# EAGLE schematic PCI da FPGA (EAGLE 6.3)
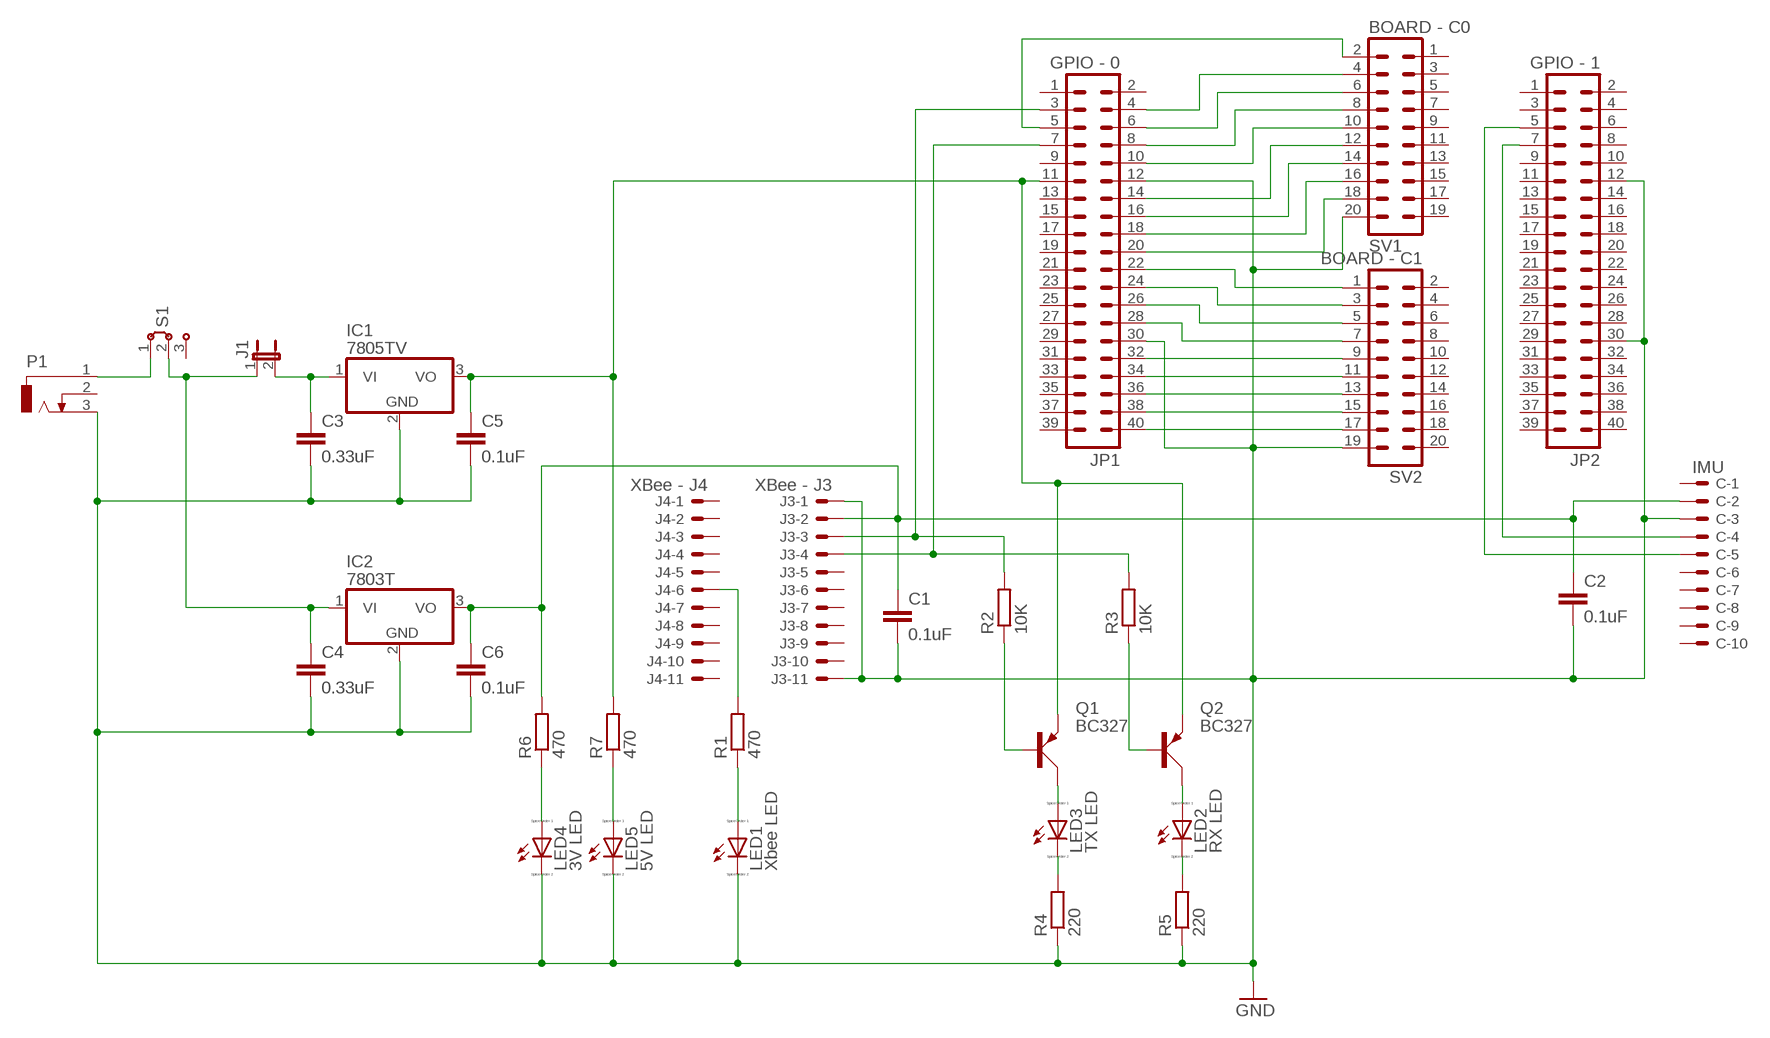
[diagram p0: schematic, sheet 1]

## Parts
C  IMU  22-23-2101  [22-23-2101]
C1  0.1uF  C5/2.5  [C5B2.5]
C2  0.1uF  C5/2.5  [C5B2.5]
C3  0.33uF  C5/2.5  [C5B2.5]
C4  0.33uF  C5/2.5  [C5B2.5]
C5  0.1uF  C5/2.5  [C5B2.5]
C6  0.1uF  C5/2.5  [C5B2.5]
IC1  7805TV  [TO220V]
IC2  7803T  7805TV  [TO220V]
J1  JP1E  [JP1]
J3  XBee - J3  22-23-2111  [22-23-2111]
J4  XBee - J4  22-23-2111  [22-23-2111]
JP1  GPIO - 0  ML40  [ML40]
JP2  GPIO - 1  ML40  [ML40]
LED1  Xbee LED  LED_ELD260  [LED_LD260]
LED2  RX LED  LED_ELD260  [LED_LD260]
LED3  TX LED  LED_ELD260  [LED_LD260]
LED4  3V LED  LED_ELD260  [LED_LD260]
LED5  5V LED  LED_ELD260  [LED_LD260]
P1  DCJ0303  [DCJ0303]
Q1  BC327  [SOT54A]
Q2  BC327  [SOT54A]
R1  470  R-EU_0207/10  [0207/10]
R2  10K  R-EU_0207/10  [0207/10]
R3  10K  R-EU_0207/10  [0207/10]
R4  220  R-EU_0207/10  [0207/10]
R5  220  R-EU_0207/10  [0207/10]
R6  470  R-EU_0207/10  [0207/10]
R7  470  R-EU_0207/10  [0207/10]
S1  J2X2MM  [04C]
SV1  BOARD - C0  ML20  [ML20]
SV2  BOARD - C1  ML20  [ML20]

## Nets
GND [PWR]: C1.2 C2.2 C3.2 C4.2 C5.2 C6.2 C.3 IC1.2(GND) IC2.2(GND) J3.1 J3.11 JP1.12 JP1.30 JP2.12 JP2.30 LED1.K(C) LED4.K(C) LED5.K(C) P1.3 R4.1 R5.1 SV1.20 SV2.19
N$1: JP1.5 SV1.2
N$2: JP1.10 SV1.10
N$3: JP1.8 SV1.8
N$4: JP1.6 SV1.6
N$5: JP1.4 SV1.4
N$6: JP1.14 SV1.12
N$7: JP1.16 SV1.14
N$8: JP1.18 SV1.16
N$9: JP1.20 SV1.18
N$10: JP1.22 SV2.1
N$11: JP1.24 SV2.3
N$12: JP1.26 SV2.5
N$13: JP1.32 SV2.9
N$14: JP1.34 SV2.11
N$15: JP1.36 SV2.13
N$16: JP1.38 SV2.15
N$17: JP1.40 SV2.17
N$18: JP1.28 SV2.7
N$19: J3.4 JP1.7 R3.2
N$20: J3.3 JP1.3 R2.2
N$21 [PWR]: C1.1 C2.1 C6.1 C.2 IC2.3(VO) J3.2 R6.2
N$22: J4.6 R1.2
N$23: LED1.A R1.1
N$24: C.5 JP2.5
N$25: C.4 JP2.7
N$26 [PWR]: P1.1 S1.1
N$27: LED2.K(C) R5.2
N$28: Q1.B R2.1
N$29: Q2.B R3.1
N$30 [PWR]: C5.1 IC1.3(VO) JP1.11 Q1.E Q2.E R7.2
N$31: LED3.A Q1.C
N$32: LED2.A Q2.C
N$33: LED3.K(C) R4.2
N$34: LED4.A R6.1
N$35: LED5.A R7.1
N$36 [PWR]: C3.1 IC1.1(VI) J1.2
N$37 [PWR]: C4.1 IC2.1(VI) J1.1 S1.2
Unconnected: C.1 C.6 C.7 C.8 C.9 C.10 J3.5 J3.6 J3.7 J3.8 J3.9 J3.10 J4.1 J4.2 J4.3 J4.4 J4.5 J4.7 J4.8 J4.9 J4.10 J4.11 JP1.1 JP1.2 JP1.9 JP1.13 JP1.15 JP1.17 JP1.19 JP1.21 JP1.23 JP1.25 JP1.27 JP1.29 JP1.31 JP1.33 JP1.35 JP1.37 JP1.39 JP2.1 JP2.2 JP2.3 JP2.4 JP2.6 JP2.8 JP2.9 JP2.10 JP2.11 JP2.13 JP2.14 JP2.15 JP2.16 JP2.17 JP2.18 JP2.19 JP2.20 JP2.21 JP2.22 JP2.23 JP2.24 JP2.25 JP2.26 JP2.27 JP2.28 JP2.29 JP2.31 JP2.32 JP2.33 JP2.34 JP2.35 JP2.36 JP2.37 JP2.38 JP2.39 JP2.40 P1.2 S1.3 SV1.1 SV1.3 SV1.5 SV1.7 SV1.9 SV1.11 SV1.13 SV1.15 SV1.17 SV1.19 SV2.2 SV2.4 SV2.6 SV2.8 SV2.10 SV2.12 SV2.14 SV2.16 SV2.18 SV2.20

## Library data of the parts
C = con-molex:22-23-2101: .100" (2.54mm) Center Header - 10 Pin; MF: MOLEX; MPN: 22-23-2101; OC_FARNELL: 1756828; OC_NEWARK: 94C0765
C1-C6 = capacitor-wima:C: CAPACITOR naming: grid - package width
IC1 IC2 = linear:78*: Positive VOLTAGE REGULATOR Source: http://cache.national.com/ds/LM/LM78L05.pdf http://www.fairchildsemi.com/ds/LM/LM7805.pdf
J1 = jumper:JP1E: JUMPER
J3 J4 = con-molex:22-23-2111: .100" (2.54mm) Center Header - 11 Pin; MF: MOLEX; MPN: 22-23-2111; OC_FARNELL: 5388879; OC_NEWARK: 27C9916
JP1 JP2 = con-harting-ml:ML40: HARTING; OC_FARNELL: unknown; OC_NEWARK: unknown
LED1-LED5 = eagle-ltspice:LED_E: LED Source: http://www.osram.convergy.de Source: www.luxeon.com Source: www.kingbright.com; SPICEMODEL: NONE; SPICEPREFIX: D; SPICETYPE: diode
P1 = con-jack:DCJ0303: DC POWER JACK Source: DCJ0303.pdf; OC_FARNELL: unknown; OC_NEWARK: unknown
Q1 Q2 = transistor-small-signal:BC327: PNP TRANSISTOR
R1-R7 = resistor:R-EU_: RESISTOR, European symbol
S1 = jumper:J2: Jumper switch 2 x 2.5 mm
SV1 SV2 = con-harting-ml:ML20: HARTING; OC_FARNELL: unknown; OC_NEWARK: unknown

## Net classes
1 PWR: width 0.508 mm